# EAGLE design level_shifter-v10 (EAGLE 6.2)
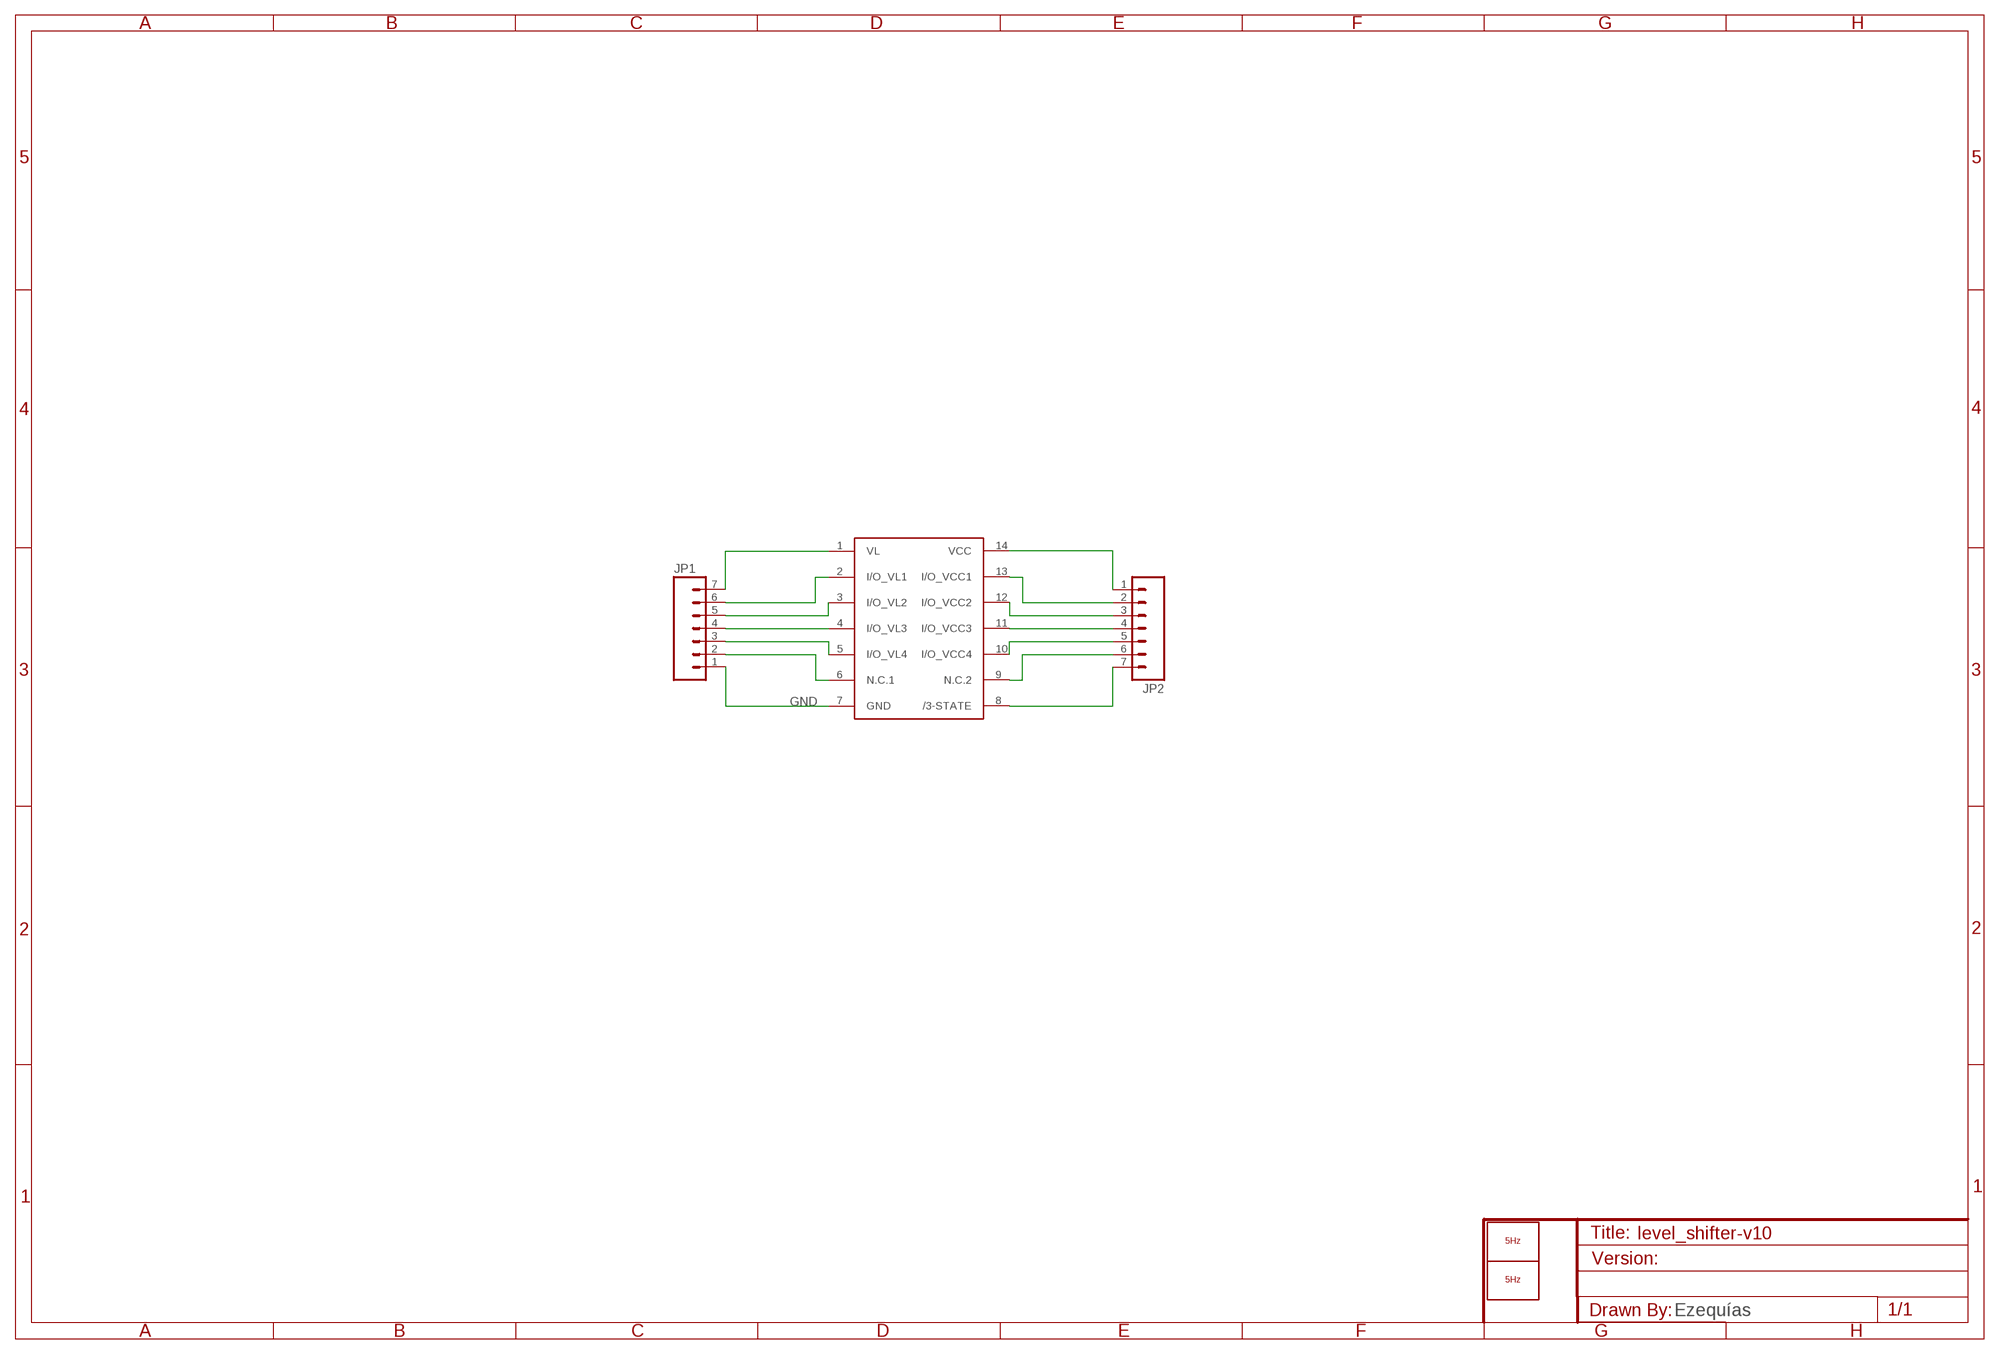
[diagram p0: schematic, sheet 1]

## Parts
JP1  M07  [1X07]
JP2  M07  [1X07]
LOGO1  LOGO_5HZ_H_COOPER_15MM  [5HZ_LOGO_H_COOPER_15MM]
LOGO2  LOGO_5HZ_MAIN_5MM  [5HZ_LOGO_MAIN_5MM]
U$1  MAX3378  [TSSOP14]

## Nets
GND: JP1.1 U$1.7(GND)
N$1: JP1.7 U$1.1(VL)
N$2: JP1.6 U$1.2(I/O_VL1)
N$3: JP1.5 U$1.3(I/O_VL2)
N$4: JP1.4 U$1.4(I/O_VL3)
N$5: JP1.3 U$1.5(I/O_VL4)
N$6: JP1.2 U$1.6(N.C.1)
N$8: JP2.7 U$1.8(/3-STATE)
N$9: JP2.6 U$1.9(N.C.2)
N$10: JP2.5 U$1.10(I/O_VCC4)
N$11: JP2.4 U$1.11(I/O_VCC3)
N$12: JP2.3 U$1.12(I/O_VCC2)
N$13: JP2.2 U$1.13(I/O_VCC1)
N$14: JP2.1 U$1.14(VCC)

## Notes on the sheet
- Ezequías

## Library data of the parts
JP1 JP2 = SparkFun:M07: Header 7 Standard 7-pin 0.1" header. Use with straight break away headers (SKU : PRT-00116), right angle break away headers (PRT-00553), swiss pins (PRT-00743), machine pins (PRT-00117), and female headers (PRT-00115). NOTES ON THE VARIANTS LOCK and LOCK_LONGPADS... This footprint was designed to help hold the alignment of a through-hole component (i.e. 7-pin header) while soldering it into place. You may notice that each hole has been shifted either up or down by 0.005 of an inch from it's more standard position (which is usually a perfectly straight line). This slight alteration caused the pins (the squares in the middle) to touch the edges of the holes. Because they are alternating, it causes a "brace" to hold the header in place. 0.005 has proven to be the perfect amount of "off-center" position when using our standard breakaway headers. Although looks a little odd when you look at the bare footprint, once you have a header in there, the alteration is very hard to notice. Also, if you push a header all the way into place, it is covered up entirely on the bottom side. This idea of altering the position of holes to aid alignment will be further integrated into the Sparkfun Library for other footprints. It can help hold any component with 3 or more connection pins.
LOGO1 LOGO2 = 5hz-electronica:LOGO_5HZ: Logotipo 5Hz "según Pedro"
U$1 = MAÑE:MAX3378

## Board
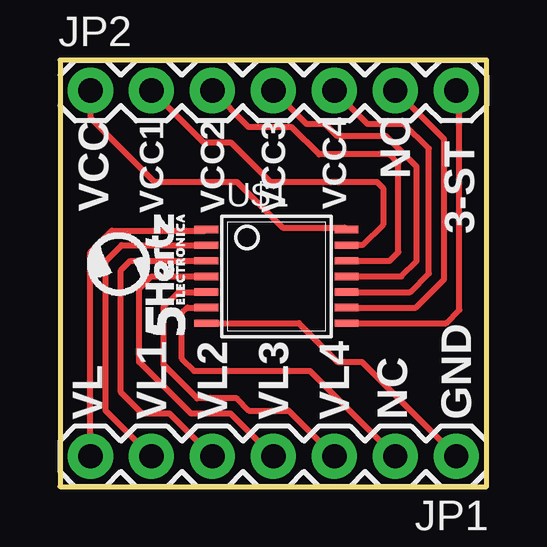
[diagram p1: board, top side]
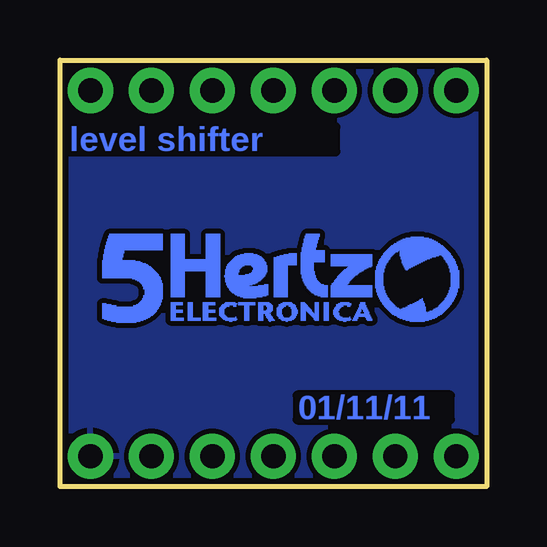
[diagram p2: board, bottom side, seen from below]

Size 17.78 x 17.78 mm. Coordinates in mm from the lower left corner, seen from the top.
Outline: 0,0 17.78,0 17.78,17.78 0,17.78 0,0
Copper layers (1*16): Top 0.035mm / dielectric 1.5mm / Bottom 0.035mm
Design rules "SparkFun": minimum track width 8mil, minimum drill 20mil, track to track 8mil, track to pad 8mil, pad to pad 8mil, via to via 8mil, smd to smd 8mil, copper to edge 10mil, drill to drill 8mil, minimum pad ring 12mil, minimum via ring 10mil, stop-mask expansion 4mil, vias tented up to drill 25mil, thermal gap 10mil

### Footprints (pad centres in the part's own frame; a part is rotated, then mirrored left to right if it is on the bottom)
1X07 = drill 1.016 pad 1.88 round: 1 0,0; 2 2.54,0; 3 5.08,0; 4 7.62,0; 5 10.16,0; 6 12.7,0; 7 15.24,0
TSSOP14 = smd 0.305 x 0.991: 1 -1.95,-2.918; 2 -1.3,-2.918; 3 -0.65,-2.918; 4 0,-2.918; 5 0.65,-2.918; 6 1.3,-2.918; 7 1.95,-2.918; 8 1.95,2.918; 9 1.3,2.918; 10 0.65,2.918; 11 0,2.918; 12 -0.65,2.918; 13 -1.3,2.918; 14 -1.95,2.918

### Placement (x,y rotation side)
JP1  16.51,1.27 180 top
JP2  1.27,16.51 0 top
LOGO1  16,6.86 0 bottom
LOGO2  5.21,6.35 90 top
U$1  9.02,8.76 270 top

### Tracks (layer width: path | path; a pad name or v marks a point on that pad's centre or on a via)
GND
  Top 0.254: U$1.7 9.95,6.81 11.56,5.21 12.57,5.21 JP1.1
  pour Bottom: 0,17.78 17.78,17.78 17.78,0 0,0
N$1
  Top 0.254: JP1.7 1.27,9.78 2.16,10.67 6.05,10.67 U$1.1
N$2
  Top 0.254: U$1.2 2.57,10.06 1.91,9.4 1.91,3.17 JP1.6
N$3
  Top 0.254: U$1.3 2.94,9.41 2.54,9.02 2.54,3.94 3.43,3.05 4.57,3.05 JP1.5
N$4
  Top 0.254: U$1.4 3.81,8.76 3.3,8.26 3.3,5.21 5.46,3.05 7.11,3.05 JP1.4
N$5
  Top 0.254: U$1.5 4.94,8.11 4.32,7.49 4.32,5.08 5.71,3.68 7.37,3.68 7.87,3.17 9.53,3.17 JP1.3
N$6
  Top 0.254: U$1.6 5.3,7.46 5.08,7.24 5.08,5.33 5.59,4.83 10.41,4.83 JP1.2
N$8
  Top 0.254: U$1.8 16.08,6.81 16.64,7.37 16.64,16.38 JP2.7
N$9
  Top 0.254: U$1.9 14.83,7.46 16,8.64 16,14.48 JP2.6
N$10
  Top 0.254: U$1.10 14.59,8.11 15.37,8.89 15.37,14.1 14.35,15.11 12.83,15.11 JP2.5
N$11
  Top 0.254: U$1.11 14.22,8.76 14.86,9.4 14.86,13.34 13.59,14.61 11.56,14.61 11.05,15.11 10.29,15.11 JP2.4
N$12
  Top 0.254: U$1.12 13.73,9.41 14.1,9.78 14.1,13.46 13.72,13.84 10.79,13.84 9.65,14.99 7.87,14.99 JP2.3
N$13
  Top 0.254: U$1.13 12.6,10.06 13.46,10.92 13.46,12.45 13.21,12.7 8.76,12.7 7.11,14.35 5.97,14.35 JP2.2
N$14
  Top 0.254: JP2.1 1.27,15.37 3.94,12.7 7.37,12.7 9.27,10.79 11.85,10.79 U$1.14

### Text on the board
Bottom: level shifter | 01/11/11
tPlace: VCC | VCC1 | VCC2 | VCC3 | NC | VCC4 | 3-ST | VL | VL1 | VL2 | VL3 | VL4 | NC | GND